# EAGLE schematic ESP012-16-Channel-PWM1 (EAGLE 7.5.0)
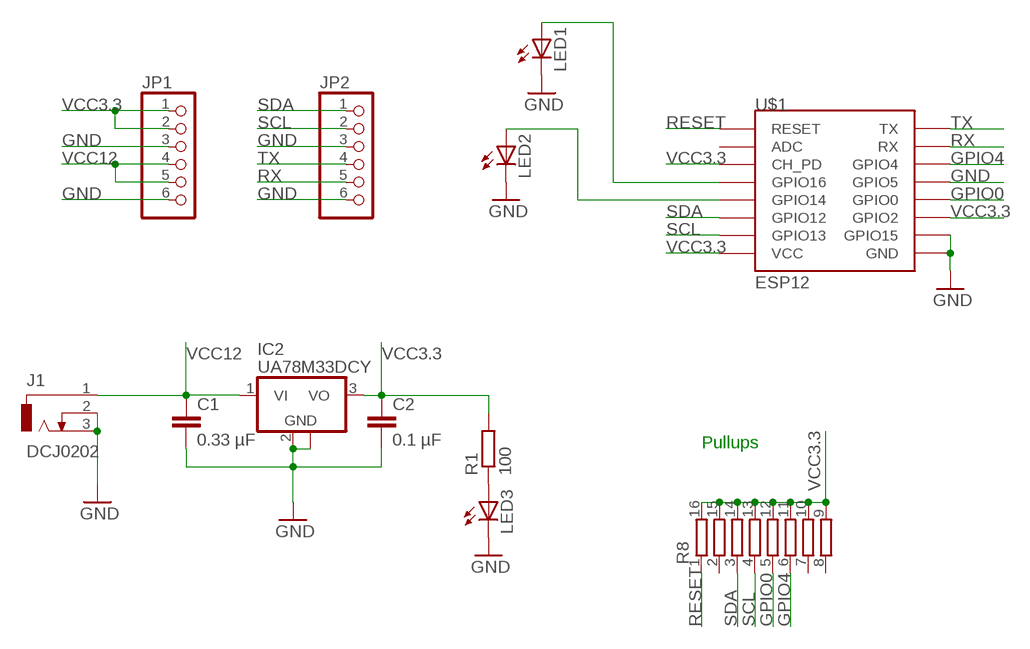
[diagram p0: schematic, sheet 1, part 1 of 2]
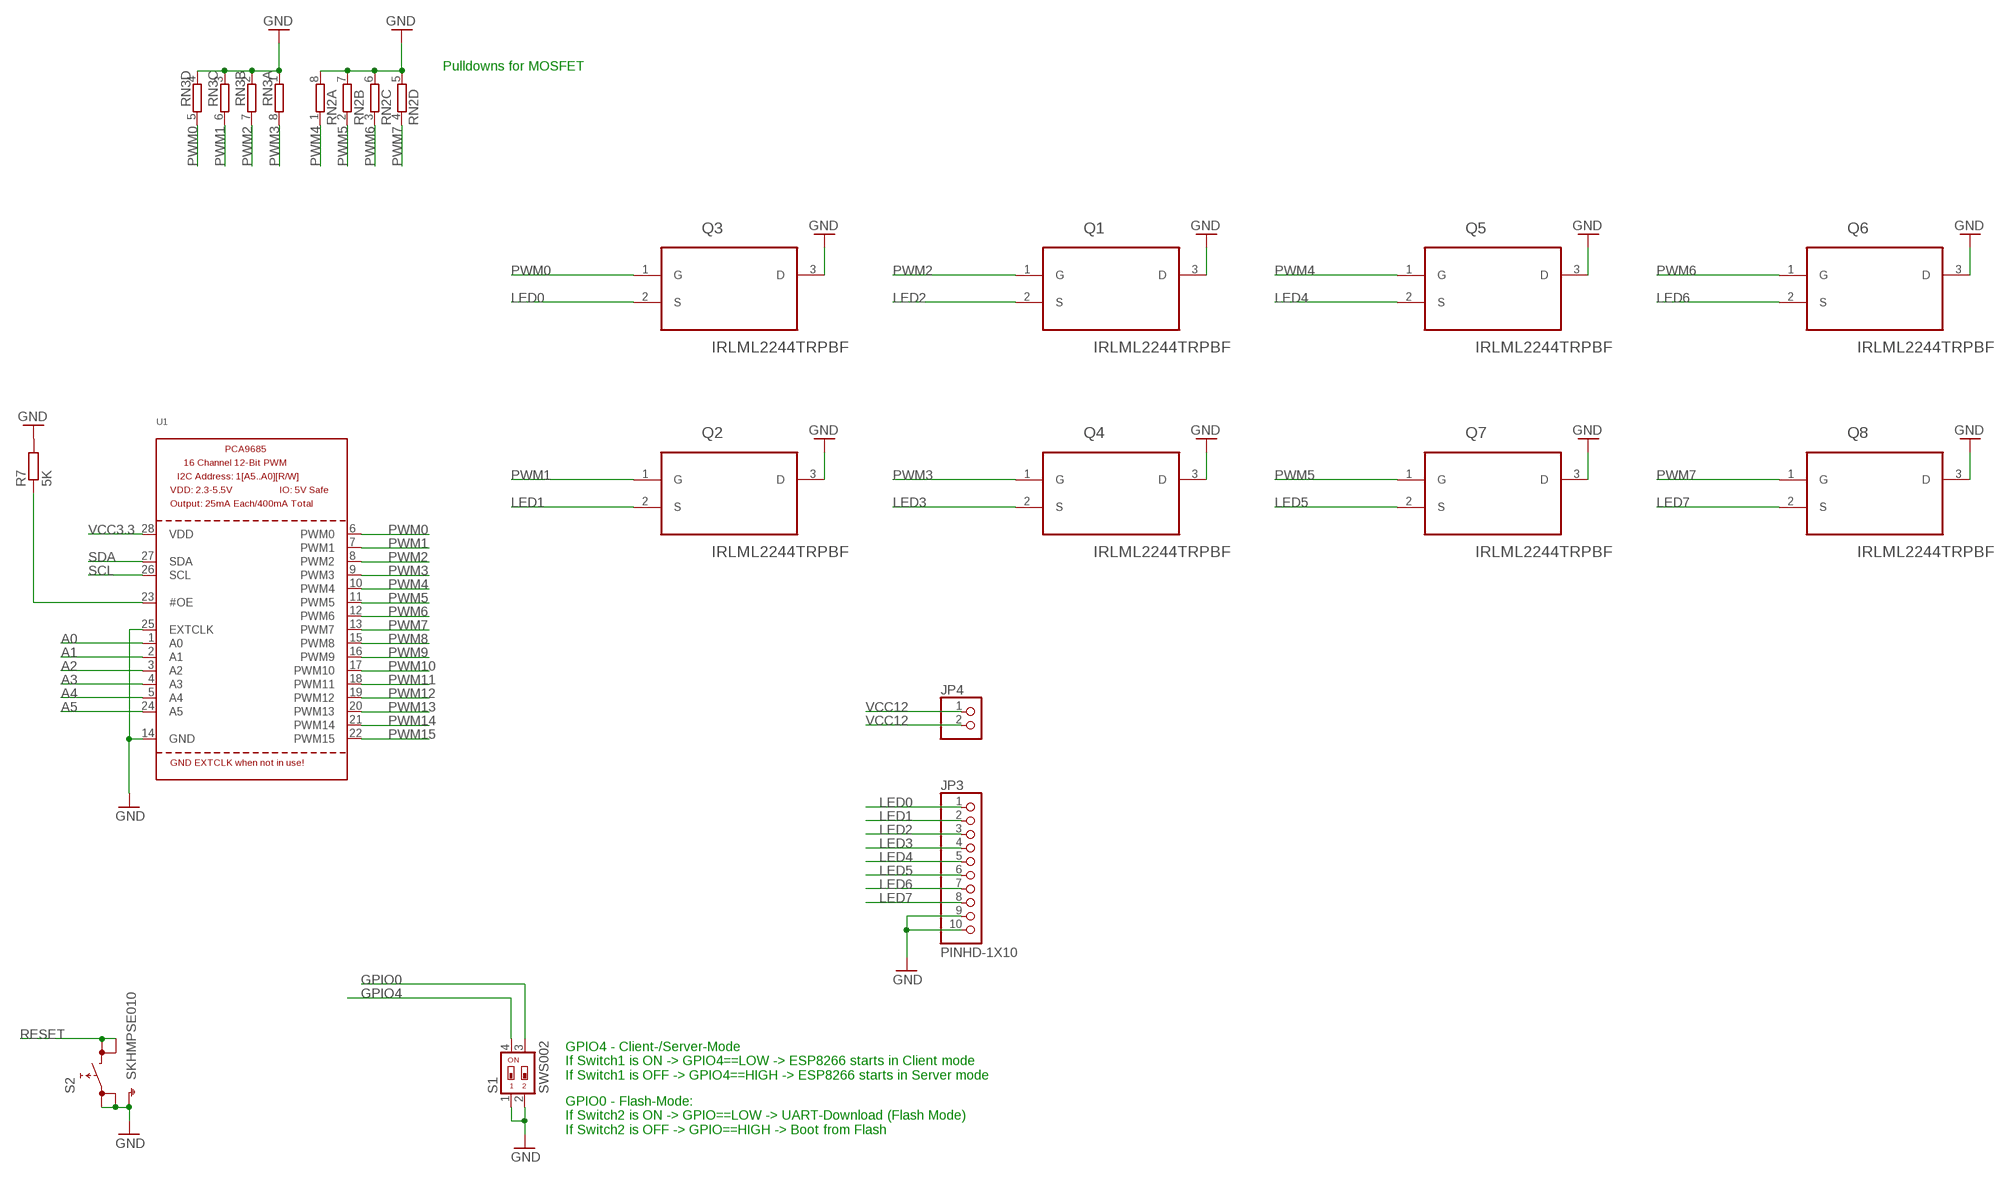
[diagram p1: schematic, sheet 1, part 2 of 2]

## Parts
C1  0.33 µF  C-EU025-024X044  [C025-024X044]
C2  0.1 µF  C-EU025-024X044  [C025-024X044]
IC2  UA78M33DCY  [SOT223]
J1  DCJ0202  [DCJ0202]
JP1  PINHD-1X6  [1X06]
JP2  PINHD-1X6  [1X06]
JP3  PINHD-1X10  [1X10-BIG]
JP4  PINHD-1X2  [1X02]
LED1  LEDCHIP-LED0805  [CHIP-LED0805]
LED2  LEDCHIP-LED0805  [CHIP-LED0805]
LED3  LEDCHIP-LED0805  [CHIP-LED0805]
Q1  IRLML2244TRPBF  [SOT95P237X112-3N]
Q2  IRLML2244TRPBF  [SOT95P237X112-3N]
Q3  IRLML2244TRPBF  [SOT95P237X112-3N]
Q4  IRLML2244TRPBF  [SOT95P237X112-3N]
Q5  IRLML2244TRPBF  [SOT95P237X112-3N]
Q6  IRLML2244TRPBF  [SOT95P237X112-3N]
Q7  IRLML2244TRPBF  [SOT95P237X112-3N]
Q8  IRLML2244TRPBF  [SOT95P237X112-3N]
R1  100  R-EU_MELF0207R  [MINI_MELF-0207R]
R7  5K  R-EU_MELF0207R  [MINI_MELF-0207R]
R8  2QSP16-8  [2QSP16]
RN2  4R-NEXBS8V  [EXBS8V]
RN3  4R-NEXBS8V  [EXBS8V]
S1  SWS002  [SMS-002]
S2  SKHMPSE010  [SKHMPXE010]
U1  PCA9685  [TSSOP28]
U$1  ESP12  [ESP12]

## Nets
A0: U1.1(A0)
A1: U1.2(A1)
A2: U1.3(A2)
A3: U1.4(A3)
A4: U1.5(A4)
A5: U1.24(A5)
GND: C1.2 C2.2 IC2.2(GND) IC2.4(GND) J1.2 J1.3 JP1.3 JP1.6 JP2.3 JP2.6 JP3.9 JP3.10 LED1.C LED2.C LED3.C Q1.3(D) Q2.3(D) Q3.3(D) Q4.3(D) Q5.3(D) Q6.3(D) Q7.3(D) Q8.3(D) R7.2 RN2.5 RN2.6 RN2.7 RN2.8 RN3.1 RN3.2 RN3.3 RN3.4 S1.1 S1.2 S2.1(1.1) S2.2(1.2) S2.5(SH) U1.14(GND) U1.25(EXTCLK) U$1.GND U$1.GPIO5 U$1.GPIO15
GPIO0: R8.5 S1.3 U$1.GPIO0
GPIO4: R8.6 S1.4 U$1.GPIO4
LED0: JP3.1 Q3.2(S)
LED1: JP3.2 Q2.2(S)
LED2: JP3.3 Q1.2(S)
LED3: JP3.4 Q4.2(S)
LED4: JP3.5 Q5.2(S)
LED5: JP3.6 Q7.2(S)
LED6: JP3.7 Q6.2(S)
LED7: JP3.8 Q8.2(S)
N$1: R7.1 U1.23(#OE)
N$2: LED1.A U$1.GPIO16
N$3: LED2.A U$1.GPIO14
N$4: LED3.A R1.1
PWM0: Q3.1(G) RN3.5 U1.6(PWM0)
PWM1: Q2.1(G) RN3.6 U1.7(PWM1)
PWM2: Q1.1(G) RN3.7 U1.8(PWM2)
PWM3: Q4.1(G) RN3.8 U1.9(PWM3)
PWM4: Q5.1(G) RN2.1 U1.10(PWM4)
PWM5: Q7.1(G) RN2.2 U1.11(PWM5)
PWM6: Q6.1(G) RN2.3 U1.12(PWM6)
PWM7: Q8.1(G) RN2.4 U1.13(PWM7)
PWM8: U1.15(PWM8)
PWM9: U1.16(PWM9)
PWM10: U1.17(PWM10)
PWM11: U1.18(PWM11)
PWM12: U1.19(PWM12)
PWM13: U1.20(PWM13)
PWM14: U1.21(PWM14)
PWM15: U1.22(PWM15)
RESET: R8.1 S2.3(2.1) S2.4(2.2) U$1.RESET
RX: JP2.5 U$1.RX
SCL: JP2.2 R8.4 U1.26(SCL) U$1.GPIO13
SDA: JP2.1 R8.3 U1.27(SDA) U$1.GPIO12
TX: JP2.4 U$1.TX
VCC3.3: C2.1 IC2.3(VO) JP1.1 JP1.2 R1.2 R8.9 R8.10 R8.11 R8.12 R8.13 R8.14 R8.15 R8.16 U1.28(VDD) U$1.CH_PD U$1.GPIO2 U$1.VCC
VCC12: C1.1 IC2.1(VI) J1.1 JP1.4 JP1.5 JP4.1 JP4.2
Unconnected: R8.2 R8.7 R8.8 U$1.ADC

## Notes on the sheet
- Pulldowns for MOSFET
- Pullups
- GPIO4 - Client-/Server-Mode
  If Switch1 is ON -> GPIO4==LOW -> ESP8266 starts in Client mode
  If Switch1 is OFF -> GPIO4==HIGH -> ESP8266 starts in Server mode
- GPIO0 - Flash-Mode:
  If Switch2 is ON -> GPIO==LOW -> UART-Download (Flash Mode)
  If Switch2 is OFF -> GPIO==HIGH -> Boot from Flash

## Library data of the parts
C1 C2 = resistor:C-EU: CAPACITOR, European symbol
IC2 = linear:UA78M*: POSITIVE-VOLTAGE REGULATORS Source: http://focus.ti.com/lit/ds/symlink/ua78m33.pdf
J1 = con-jack:DCJ0202: DC POWER JACK Source: DCJ0202.pdf; OC_FARNELL: unknown; OC_NEWARK: unknown
JP1 JP2 = pinhead:PINHD-1X6: PIN HEADER
JP3 = adafruit:PINHD-1X10: Pin header 1x10 0.1" spacing With round pins
JP4 = pinhead:PINHD-1X2: PIN HEADER
LED1-LED3 = adafruit:LED: LED OSRAM: - CHIPLED LG R971, LG N971, LY N971, LG Q971, LY Q971, LO R971, LY R971 LH N974, LH R974 LS Q976, LO Q976, LY Q976 LO Q996 - Hyper CHIPLED LW Q18S LB Q993, LB Q99A, LB R99A - SideLED LS A670, LO A670, LY A670, LG A670, LP A670 LB A673, LV A673, LT A673, LW A673 LH A674 LY A675 LS A676, LA A676, LO A676, LY A676, LW A676 LS A679, LY A679, LG A679 - Hyper Micro SIDELED® LS Y876, LA Y876, LO Y876, LY Y876 LT Y87S - SmartLED LW L88C, LW L88S LB L89C, LB L89S, LG L890 LS L89K, LO L89K, LY L89K LS L896, LA L896, LO L896, LY L896 - TOPLED LS T670, LO T670, LY T670, LG T670, LP T670 LSG T670, LSP T670, LSY T670, LOP T670, LYG T670 LG T671, LOG T671, LSG T671 LB T673, LV T673, LT T673, LW T673 LH T674 LS T676, LA T676, LO T676, LY T676, LB T676, LH T676, LSB T676, LW T676 LB T67C, LV T67C, LT T67C, LS T67K, LO T67K, LY T67K, LW E67C LS E67B, LA E67B, LO E67B, LY E67B, LB E67C, LV E67C, LT E67C LW T67C LS T679, LY T679, LG T679 LS T770, LO T770, LY T770, LG T770, LP T770 LB T773, LV T773, LT T773, LW T773 LH T774 LS E675, LA E675, LY E675, LS T675 LS T776, LA T776, LO T776, LY T776, LB T776 LHGB T686 LT T68C, LB T68C - Hyper Mini TOPLED® LB M676 - Mini TOPLED Santana® LG M470 LS M47K, LO M47K, LY M47K Source: http://www.osram.convergy.de/
Q1-Q8 = International_Rectifier_By_element14_Batch_1:IRLML2244TRPBF: HEXFET Power MOSFET; MPN: IRLML2244TRPBF; OC_FARNELL: 1888165; OC_NEWARK: 40T7448; PACKAGE: SOT-3; SUPPLIER: International Rectifier
R1 R7 = rcl:R-EU_: RESISTOR, European symbol
R8 = resistor-bourns:2QSP16-8: BOURNS RESISTOR NETWORK; OC_FARNELL: unknown; OC_NEWARK: unknown
RN2 RN3 = resistor-dil:4R-N: Array Chip Resistor Source: RS Component / Phycomp; OC_FARNELL: unknown; OC_NEWARK: unknown
S1 = smd-special:SWS002: SMD Dip Switch 2 pol.
S2 = switch:SKHMP*E010: 6.2 X 6.5mm TACT Switch (SMD) Source: http://www3.alps.co.jp/WebObjects/catalog.woa/PDF/E/Switch/Tact/SKHM/SKHM.PDF
U1 = adafruit:PCA9685: PCA9685 - 16 Channel 12-Bit I2C PWM Controller 5.0V tolerant 16 channel, 12-bit I2C PWM controller with 25mA per output (max. 400mA total) Digikey: 568-5931-1-ND
U$1 = esp8266modules:ESP12: ESP8266 Wifi module 12

## Net classes
0 default: drill 0.6 mm
1 GND: drill 0.6 mm